# Altium project EVK-NORA-W40.PrjPcb (part 4 of 4)
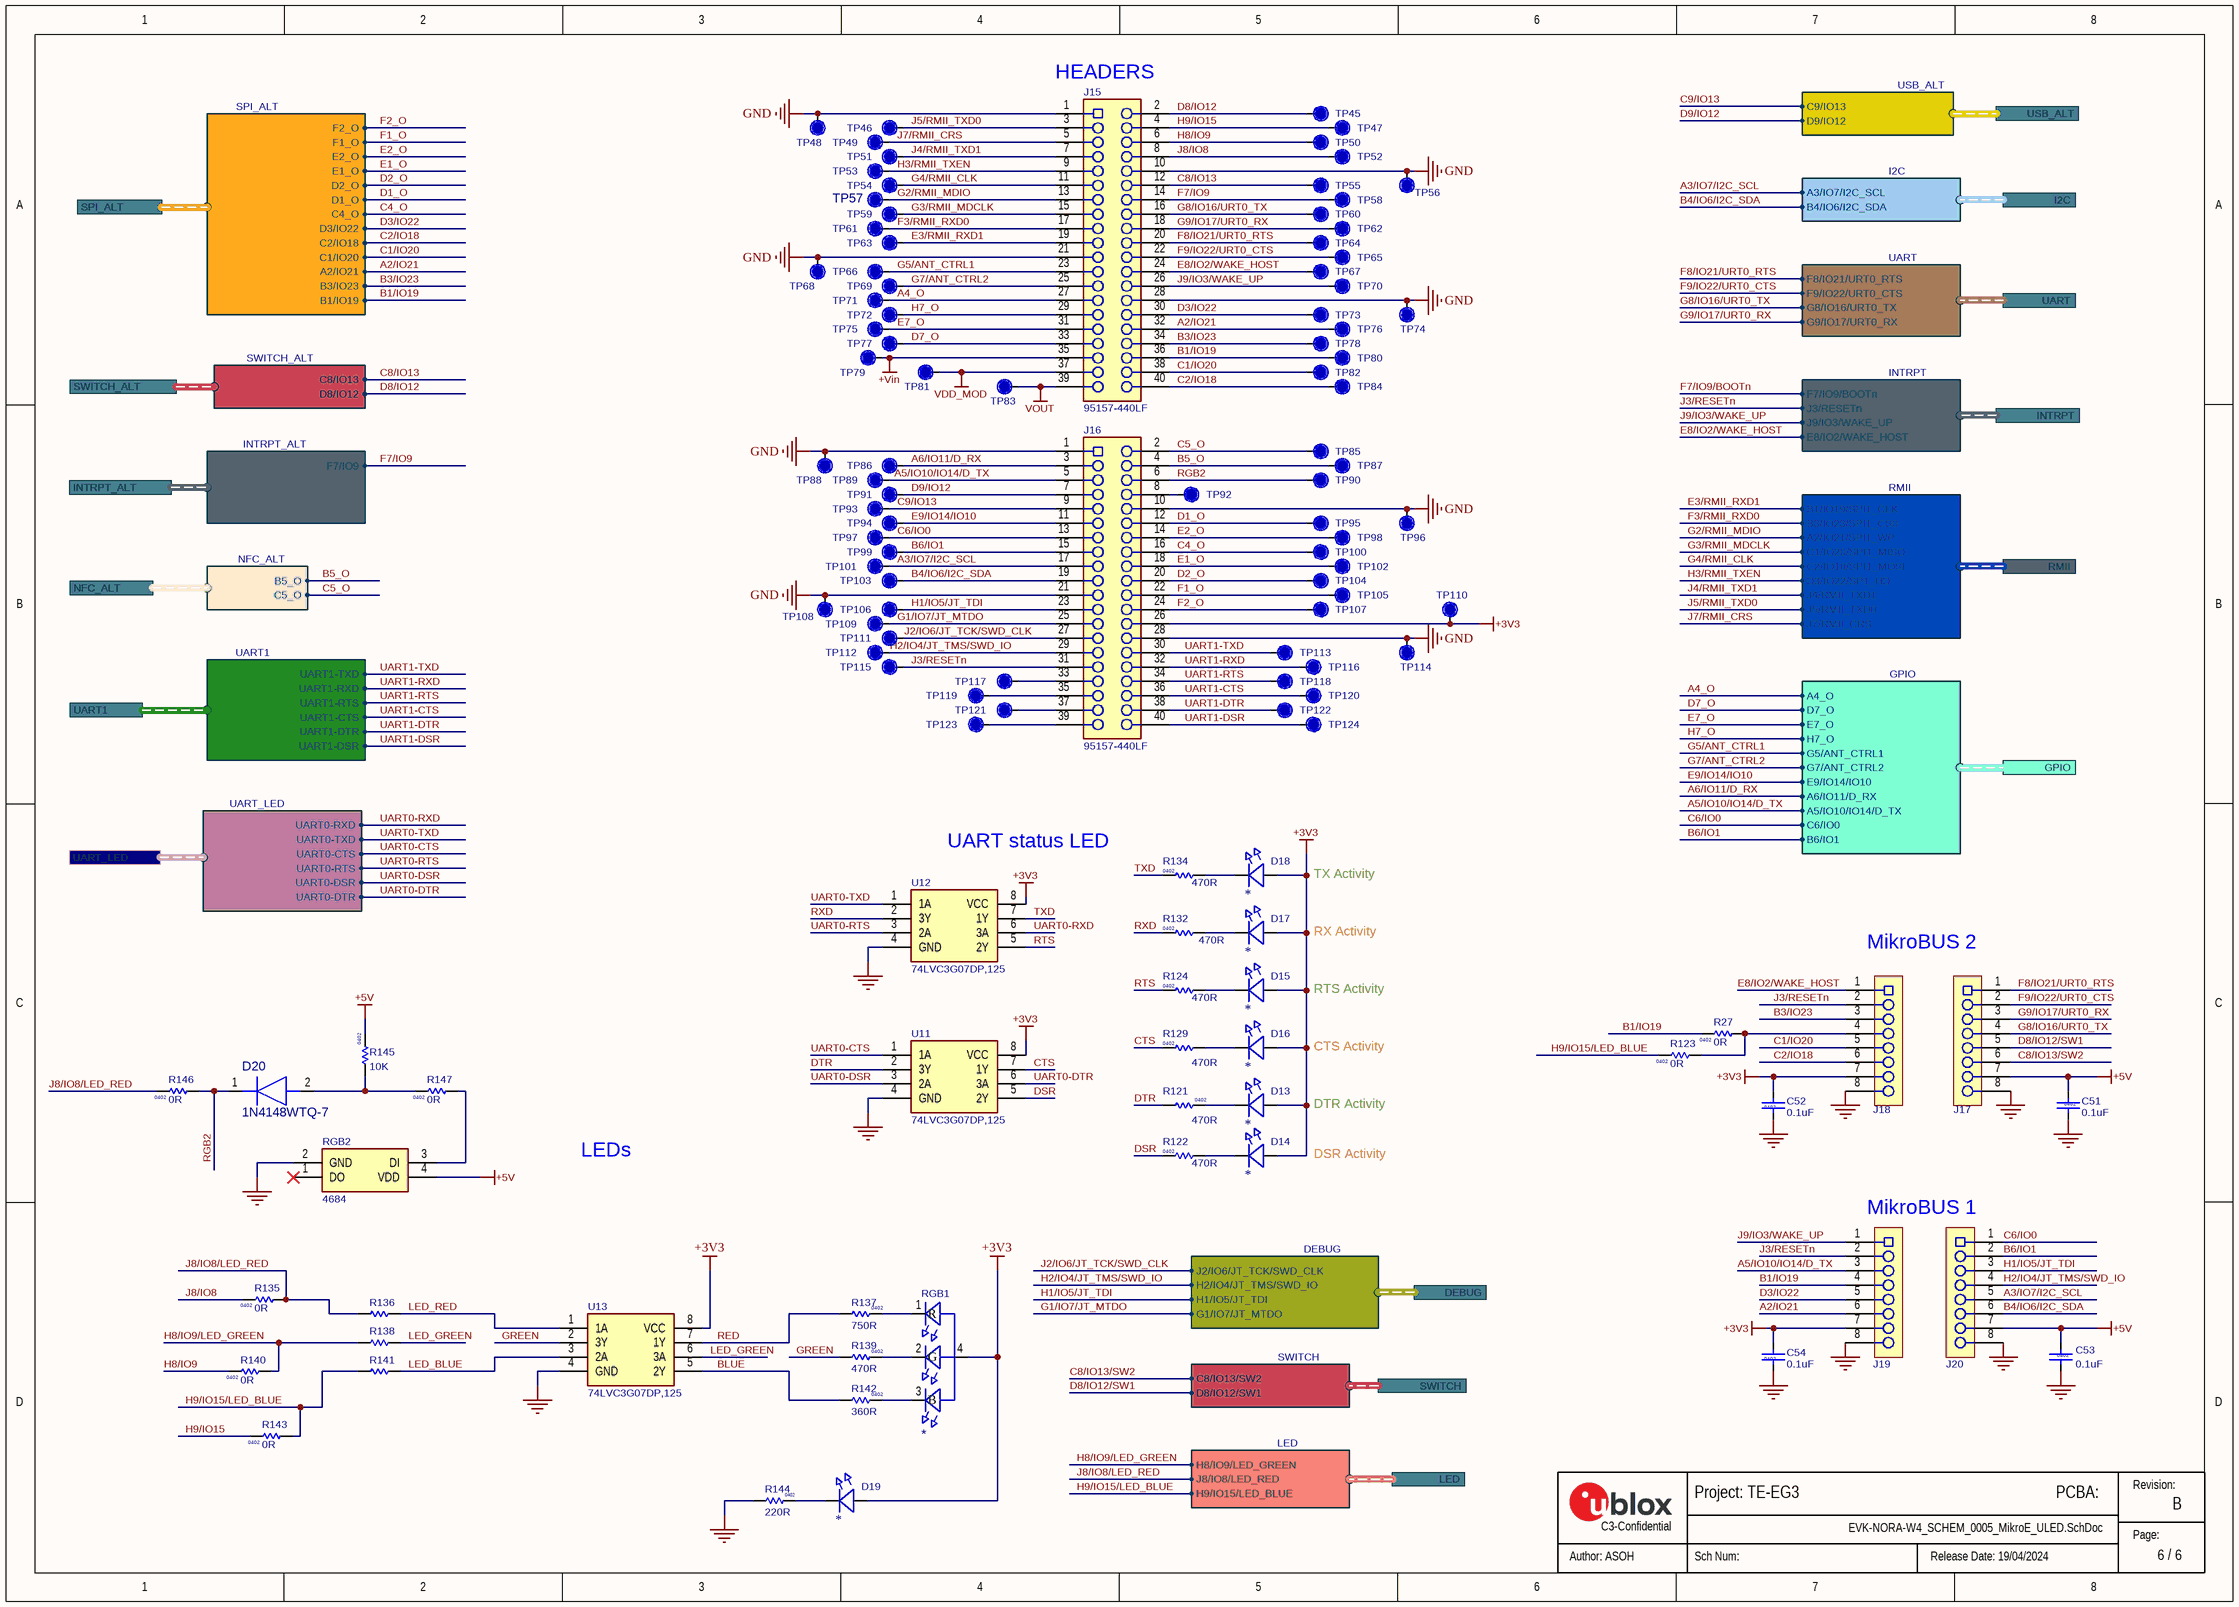
[diagram p6: EVK-NORA-W4_SCHEM_0005_MikroE_ULED.SchDoc]

## Nets that join several sheets
+3V3: EVK-NORA-W4_SCHEM_0001_Power (5 pins), EVK-NORA-W4_SCHEM_0003_USBhub_FTDI (13 pins), EVK-NORA-W4_SCHEM_0004_Debug_Memory (J12.2 R70.2 R71.2), EVK-NORA-W4_SCHEM_0005_MikroE_ULED (17 pins)
+5V: EVK-NORA-W4_SCHEM_0001_Power (R148.2 SW1.4), EVK-NORA-W4_SCHEM_0002_NORA_Module (R3.1), EVK-NORA-W4_SCHEM_0004_Debug_Memory (J11.5), EVK-NORA-W4_SCHEM_0005_MikroE_ULED (6 pins)
+Vin: EVK-NORA-W4_SCHEM_0001_Power (D2.A), EVK-NORA-W4_SCHEM_0005_MikroE_ULED (J15.35 TP79.1)
GND: EVK-NORA-W4_SCHEM_0001_Power (56 pins), EVK-NORA-W4_SCHEM_0002_NORA_Module (34 pins), EVK-NORA-W4_SCHEM_0003_USBhub_FTDI (35 pins), EVK-NORA-W4_SCHEM_0004_Debug_Memory (26 pins), EVK-NORA-W4_SCHEM_0005_MikroE_ULED (29 pins)
VDD_IO: EVK-NORA-W4_SCHEM_0001_Power (R36.2), EVK-NORA-W4_SCHEM_0002_NORA_Module (J4.2 R10.2 S1.2), EVK-NORA-W4_SCHEM_0003_USBhub_FTDI (R93.1 R111.1 TP28.1)
VDD_MOD: EVK-NORA-W4_SCHEM_0001_Power (7 pins), EVK-NORA-W4_SCHEM_0002_NORA_Module (J3.2 R6.2 S1.1), EVK-NORA-W4_SCHEM_0004_Debug_Memory (5 pins), EVK-NORA-W4_SCHEM_0005_MikroE_ULED (J15.37 TP81.1)
VDD_SPI: EVK-NORA-W4_SCHEM_0002_NORA_Module (U1.J1), EVK-NORA-W4_SCHEM_0004_Debug_Memory (R63.1 R75.1)
VOUT: EVK-NORA-W4_SCHEM_0001_Power (R29.1 R41.1 R148.1 SW1.1), EVK-NORA-W4_SCHEM_0005_MikroE_ULED (J15.39 TP83.1)
A2/IO21: EVK-NORA-W4_SCHEM_0004_Debug_Memory (R65.2), EVK-NORA-W4_SCHEM_0005_MikroE_ULED (J15.32 J19.6 TP76.1)
A2/IO21/SPI1_WP: EVK-NORA-W4_SCHEM_0002_NORA_Module (R4.1 S2.12), EVK-NORA-W4_SCHEM_0004_Debug_Memory (R65.1 U5.3)
A3/IO7/I2C_SCL: EVK-NORA-W4_SCHEM_0002_NORA_Module (R5.1 S2.10), EVK-NORA-W4_SCHEM_0004_Debug_Memory (R72.2), EVK-NORA-W4_SCHEM_0005_MikroE_ULED (J16.17 J20.5 TP101.1)
A4_O: EVK-NORA-W4_SCHEM_0002_NORA_Module (U1.A4), EVK-NORA-W4_SCHEM_0005_MikroE_ULED (J15.27 TP71.1)
A5/IO10/IO14/D_TX: EVK-NORA-W4_SCHEM_0002_NORA_Module (R7.1 S2.9), EVK-NORA-W4_SCHEM_0005_MikroE_ULED (J16.5 J19.3 TP89.1)
A6/IO11/D_RX: EVK-NORA-W4_SCHEM_0002_NORA_Module (U1.A6), EVK-NORA-W4_SCHEM_0005_MikroE_ULED (J16.3 TP86.1)
B1/IO19: EVK-NORA-W4_SCHEM_0004_Debug_Memory (R68.1), EVK-NORA-W4_SCHEM_0005_MikroE_ULED (J15.36 J19.4 R27.2 TP80.1)
B1/IO19/SPI1_CLK: EVK-NORA-W4_SCHEM_0002_NORA_Module (U1.B1), EVK-NORA-W4_SCHEM_0004_Debug_Memory (R68.2 U5.6)
B3/IO23: EVK-NORA-W4_SCHEM_0004_Debug_Memory (R66.1), EVK-NORA-W4_SCHEM_0005_MikroE_ULED (J15.34 J18.3 TP78.1)
B3/IO23/SPI1_CS0: EVK-NORA-W4_SCHEM_0002_NORA_Module (U1.B3), EVK-NORA-W4_SCHEM_0004_Debug_Memory (R66.2 U5.1)
B4/IO6/I2C_SDA: EVK-NORA-W4_SCHEM_0002_NORA_Module (R8.1 S2.11), EVK-NORA-W4_SCHEM_0004_Debug_Memory (R73.2), EVK-NORA-W4_SCHEM_0005_MikroE_ULED (J16.19 J20.6 TP103.1)
B5/NFC2: EVK-NORA-W4_SCHEM_0002_NORA_Module (U1.B5), EVK-NORA-W4_SCHEM_0003_USBhub_FTDI (C35.1 J14.4 R86.1)
B5_O: EVK-NORA-W4_SCHEM_0003_USBhub_FTDI (R86.2), EVK-NORA-W4_SCHEM_0005_MikroE_ULED (J16.4 TP87.1)
B6/IO1: EVK-NORA-W4_SCHEM_0002_NORA_Module (R25.2), EVK-NORA-W4_SCHEM_0005_MikroE_ULED (J16.15 J20.2 TP99.1)
C1/IO20: EVK-NORA-W4_SCHEM_0004_Debug_Memory (R67.2), EVK-NORA-W4_SCHEM_0005_MikroE_ULED (J15.38 J18.5 TP82.1)
C1/IO20/SPI1_MISO: EVK-NORA-W4_SCHEM_0002_NORA_Module (U1.C1), EVK-NORA-W4_SCHEM_0004_Debug_Memory (R67.1 U5.2)
C2/IO18: EVK-NORA-W4_SCHEM_0004_Debug_Memory (R69.2), EVK-NORA-W4_SCHEM_0005_MikroE_ULED (J15.40 J18.6 TP84.1)
C2/IO18/SPI1_MOSI: EVK-NORA-W4_SCHEM_0002_NORA_Module (U1.C2), EVK-NORA-W4_SCHEM_0004_Debug_Memory (R69.1 U5.5)
C4/SPI2_CS1: EVK-NORA-W4_SCHEM_0002_NORA_Module (U1.C4), EVK-NORA-W4_SCHEM_0004_Debug_Memory (R81.2 R82.2)
C4_O: EVK-NORA-W4_SCHEM_0004_Debug_Memory (R82.1), EVK-NORA-W4_SCHEM_0005_MikroE_ULED (J16.16 TP100.1)
C5/NFC1: EVK-NORA-W4_SCHEM_0002_NORA_Module (U1.C5), EVK-NORA-W4_SCHEM_0003_USBhub_FTDI (C34.2 J14.2 R85.2)
C5_O: EVK-NORA-W4_SCHEM_0003_USBhub_FTDI (R85.1), EVK-NORA-W4_SCHEM_0005_MikroE_ULED (J16.2 TP85.1)
C6/IO0: EVK-NORA-W4_SCHEM_0002_NORA_Module (R21.2), EVK-NORA-W4_SCHEM_0005_MikroE_ULED (J16.13 J20.1 TP97.1)
C8/IO13: EVK-NORA-W4_SCHEM_0004_Debug_Memory (R60.1), EVK-NORA-W4_SCHEM_0005_MikroE_ULED (J15.12 TP55.1)
C8/IO13/SW2: EVK-NORA-W4_SCHEM_0002_NORA_Module (R12.1 S3.12), EVK-NORA-W4_SCHEM_0004_Debug_Memory (D11.1 R60.2 SW4.1 SW4.2), EVK-NORA-W4_SCHEM_0005_MikroE_ULED (J17.6)
C9/IO13: EVK-NORA-W4_SCHEM_0002_NORA_Module (R1.2), EVK-NORA-W4_SCHEM_0005_MikroE_ULED (J16.9 TP93.1)
C9/IO13/USB_p: EVK-NORA-W4_SCHEM_0001_Power (D4.2 J5.A6 J5.B6 TP3.1), EVK-NORA-W4_SCHEM_0002_NORA_Module (C2.1 R1.1 R13.1 S3.11)
D1/SPI2_WP: EVK-NORA-W4_SCHEM_0002_NORA_Module (U1.D1), EVK-NORA-W4_SCHEM_0004_Debug_Memory (R77.1 U6.3)
D1_O: EVK-NORA-W4_SCHEM_0004_Debug_Memory (R77.2), EVK-NORA-W4_SCHEM_0005_MikroE_ULED (J16.12 TP95.1)
D2/SPI2_MOSI: EVK-NORA-W4_SCHEM_0002_NORA_Module (U1.D2), EVK-NORA-W4_SCHEM_0004_Debug_Memory (R83.1 U6.5)
D2_O: EVK-NORA-W4_SCHEM_0004_Debug_Memory (R83.2), EVK-NORA-W4_SCHEM_0005_MikroE_ULED (J16.20 TP104.1)
D3/IO22: EVK-NORA-W4_SCHEM_0004_Debug_Memory (R62.2), EVK-NORA-W4_SCHEM_0005_MikroE_ULED (J15.30 J19.5 TP73.1)
D3/IO22/SP1_HD: EVK-NORA-W4_SCHEM_0002_NORA_Module (R14.1 S2.13), EVK-NORA-W4_SCHEM_0004_Debug_Memory (R62.1 U5.7)
D7_O: EVK-NORA-W4_SCHEM_0002_NORA_Module (U1.D7), EVK-NORA-W4_SCHEM_0005_MikroE_ULED (J15.33 TP77.1)
D8/IO12: EVK-NORA-W4_SCHEM_0004_Debug_Memory (R57.1), EVK-NORA-W4_SCHEM_0005_MikroE_ULED (J15.2 TP45.1)
D8/IO12/SW1: EVK-NORA-W4_SCHEM_0002_NORA_Module (R15.1 S3.9), EVK-NORA-W4_SCHEM_0004_Debug_Memory (D10.1 R57.2 SW2.1 SW2.2), EVK-NORA-W4_SCHEM_0005_MikroE_ULED (J17.5)
D9/IO12: EVK-NORA-W4_SCHEM_0002_NORA_Module (R2.2), EVK-NORA-W4_SCHEM_0005_MikroE_ULED (J16.7 TP91.1)
D9/IO12/USB_n: EVK-NORA-W4_SCHEM_0001_Power (D4.1 J5.A7 J5.B7 TP2.1), EVK-NORA-W4_SCHEM_0002_NORA_Module (C1.1 R2.1 R16.1 S3.10)
E1/SPI2_CS0: EVK-NORA-W4_SCHEM_0002_NORA_Module (U1.E1), EVK-NORA-W4_SCHEM_0004_Debug_Memory (R78.2 R79.2)
E1_O: EVK-NORA-W4_SCHEM_0004_Debug_Memory (R78.1), EVK-NORA-W4_SCHEM_0005_MikroE_ULED (J16.18 TP102.1)
E2/SPI2_MISO: EVK-NORA-W4_SCHEM_0002_NORA_Module (U1.E2), EVK-NORA-W4_SCHEM_0004_Debug_Memory (R80.1 U6.2)
E2_O: EVK-NORA-W4_SCHEM_0004_Debug_Memory (R80.2), EVK-NORA-W4_SCHEM_0005_MikroE_ULED (J16.14 TP98.1)
E3/RMII_RXD1: EVK-NORA-W4_SCHEM_0002_NORA_Module (U1.E3), EVK-NORA-W4_SCHEM_0005_MikroE_ULED (J15.19 TP63.1)
E7_O: EVK-NORA-W4_SCHEM_0002_NORA_Module (U1.E7), EVK-NORA-W4_SCHEM_0005_MikroE_ULED (J15.31 TP75.1)
E8/IO2/WAKE_HOST: EVK-NORA-W4_SCHEM_0002_NORA_Module (U1.E8), EVK-NORA-W4_SCHEM_0003_USBhub_FTDI (R88.2 S4.8), EVK-NORA-W4_SCHEM_0005_MikroE_ULED (J15.24 J18.1 TP67.1)
E9/IO14/IO10: EVK-NORA-W4_SCHEM_0002_NORA_Module (C9.2 R19.1 S3.13), EVK-NORA-W4_SCHEM_0005_MikroE_ULED (J16.11 TP94.1)
F1/SPI2_CLK: EVK-NORA-W4_SCHEM_0002_NORA_Module (U1.F1), EVK-NORA-W4_SCHEM_0004_Debug_Memory (R84.2 U6.6)
F1_O: EVK-NORA-W4_SCHEM_0004_Debug_Memory (R84.1), EVK-NORA-W4_SCHEM_0005_MikroE_ULED (J16.22 TP105.1)
F2/SPI2_HD: EVK-NORA-W4_SCHEM_0002_NORA_Module (U1.F2), EVK-NORA-W4_SCHEM_0004_Debug_Memory (R74.1 U6.7)
F2_O: EVK-NORA-W4_SCHEM_0004_Debug_Memory (R74.2), EVK-NORA-W4_SCHEM_0005_MikroE_ULED (J16.24 TP107.1)
F3/RMII_RXD0: EVK-NORA-W4_SCHEM_0002_NORA_Module (U1.F3), EVK-NORA-W4_SCHEM_0005_MikroE_ULED (J15.17 TP61.1)
F7/IO9: EVK-NORA-W4_SCHEM_0004_Debug_Memory (R61.1), EVK-NORA-W4_SCHEM_0005_MikroE_ULED (J15.14 TP58.1)
F7/IO9/BOOTn: EVK-NORA-W4_SCHEM_0002_NORA_Module (R22.1 S3.16), EVK-NORA-W4_SCHEM_0003_USBhub_FTDI (R117.1), EVK-NORA-W4_SCHEM_0004_Debug_Memory (D12.1 R61.2 SW5.1 SW5.2)
F8/IO21/URT0_RTS: EVK-NORA-W4_SCHEM_0002_NORA_Module (R23.1 S3.15), EVK-NORA-W4_SCHEM_0003_USBhub_FTDI (R90.2 S4.10), EVK-NORA-W4_SCHEM_0005_MikroE_ULED (J15.20 J17.1 TP64.1)
F9/IO22/URT0_CTS: EVK-NORA-W4_SCHEM_0002_NORA_Module (R24.1 S3.14), EVK-NORA-W4_SCHEM_0003_USBhub_FTDI (R89.2 S4.9), EVK-NORA-W4_SCHEM_0005_MikroE_ULED (J15.22 J17.2 TP65.1)
G1/IO7/JT_MTDO: EVK-NORA-W4_SCHEM_0002_NORA_Module (R28.2 S2.14), EVK-NORA-W4_SCHEM_0004_Debug_Memory (J9.6 J11.6), EVK-NORA-W4_SCHEM_0005_MikroE_ULED (J16.25 TP109.1)
G2/RMII_MDIO: EVK-NORA-W4_SCHEM_0002_NORA_Module (U1.G2), EVK-NORA-W4_SCHEM_0005_MikroE_ULED (J15.13 TP57.1)
G3/RMII_MDCLK: EVK-NORA-W4_SCHEM_0002_NORA_Module (U1.G3), EVK-NORA-W4_SCHEM_0005_MikroE_ULED (J15.15 TP59.1)
G4/RMII_CLK: EVK-NORA-W4_SCHEM_0002_NORA_Module (U1.G4), EVK-NORA-W4_SCHEM_0005_MikroE_ULED (J15.11 TP54.1)
G5/ANT_CTRL1: EVK-NORA-W4_SCHEM_0002_NORA_Module (U1.G5), EVK-NORA-W4_SCHEM_0005_MikroE_ULED (J15.23 TP66.1)
G7/ANT_CTRL2: EVK-NORA-W4_SCHEM_0002_NORA_Module (U1.G7), EVK-NORA-W4_SCHEM_0005_MikroE_ULED (J15.25 TP69.1)
G8/IO16/URT0_TX: EVK-NORA-W4_SCHEM_0002_NORA_Module (U1.G8), EVK-NORA-W4_SCHEM_0003_USBhub_FTDI (R92.2 S4.12), EVK-NORA-W4_SCHEM_0005_MikroE_ULED (J15.16 J17.4 TP60.1)
G9/IO17/URT0_RX: EVK-NORA-W4_SCHEM_0002_NORA_Module (U1.G9), EVK-NORA-W4_SCHEM_0003_USBhub_FTDI (R91.2 S4.11), EVK-NORA-W4_SCHEM_0005_MikroE_ULED (J15.18 J17.3 TP62.1)
H1/IO5/JT_TDI: EVK-NORA-W4_SCHEM_0002_NORA_Module (U1.H1), EVK-NORA-W4_SCHEM_0004_Debug_Memory (J9.8 J11.8), EVK-NORA-W4_SCHEM_0005_MikroE_ULED (J16.23 J20.3 TP106.1)
H2/IO4/JT_TMS/SWD_IO: EVK-NORA-W4_SCHEM_0002_NORA_Module (U1.H2), EVK-NORA-W4_SCHEM_0004_Debug_Memory (J9.2 J11.2), EVK-NORA-W4_SCHEM_0005_MikroE_ULED (J16.29 J20.4 TP112.1)
H3/RMII_TXEN: EVK-NORA-W4_SCHEM_0002_NORA_Module (U1.H3), EVK-NORA-W4_SCHEM_0005_MikroE_ULED (J15.9 TP53.1)
H7_O: EVK-NORA-W4_SCHEM_0002_NORA_Module (U1.H7), EVK-NORA-W4_SCHEM_0005_MikroE_ULED (J15.29 TP72.1)
H8/IO9/LED_GREEN: EVK-NORA-W4_SCHEM_0002_NORA_Module (R20.2 S2.15), EVK-NORA-W4_SCHEM_0005_MikroE_ULED (R138.2 R140.1)
H9/IO15/LED_BLUE: EVK-NORA-W4_SCHEM_0002_NORA_Module (U1.H9), EVK-NORA-W4_SCHEM_0005_MikroE_ULED (R123.2 R141.2 R143.1)
J2/IO6/JT_TCK/SWD_CLK: EVK-NORA-W4_SCHEM_0002_NORA_Module (R18.2 S2.16), EVK-NORA-W4_SCHEM_0004_Debug_Memory (J9.4 J11.4), EVK-NORA-W4_SCHEM_0005_MikroE_ULED (J16.27 TP111.1)
J3/RESETn: EVK-NORA-W4_SCHEM_0002_NORA_Module (R17.2), EVK-NORA-W4_SCHEM_0003_USBhub_FTDI (R118.2), EVK-NORA-W4_SCHEM_0004_Debug_Memory (J9.10 J11.10 R59.1), EVK-NORA-W4_SCHEM_0005_MikroE_ULED (J16.31 J18.2 J19.2 TP115.1)
J4/RMII_TXD1: EVK-NORA-W4_SCHEM_0002_NORA_Module (U1.J4), EVK-NORA-W4_SCHEM_0005_MikroE_ULED (J15.7 TP51.1)
J5/RMII_TXD0: EVK-NORA-W4_SCHEM_0002_NORA_Module (U1.J5), EVK-NORA-W4_SCHEM_0005_MikroE_ULED (J15.3 TP46.1)
J7/RMII_CRS: EVK-NORA-W4_SCHEM_0002_NORA_Module (U1.J7), EVK-NORA-W4_SCHEM_0005_MikroE_ULED (J15.5 TP49.1)
J8/IO8/LED_RED: EVK-NORA-W4_SCHEM_0002_NORA_Module (U1.J8), EVK-NORA-W4_SCHEM_0005_MikroE_ULED (R135.1 R136.2 R146.2)
J9/IO3/WAKE_UP: EVK-NORA-W4_SCHEM_0002_NORA_Module (U1.J9), EVK-NORA-W4_SCHEM_0003_USBhub_FTDI (R87.2 S4.7), EVK-NORA-W4_SCHEM_0005_MikroE_ULED (J15.26 J19.1 TP70.1)
UART0-CTS: EVK-NORA-W4_SCHEM_0003_USBhub_FTDI (6 pins), EVK-NORA-W4_SCHEM_0005_MikroE_ULED (U11.1)
UART0-DSR: EVK-NORA-W4_SCHEM_0003_USBhub_FTDI (6 pins), EVK-NORA-W4_SCHEM_0005_MikroE_ULED (U11.3)
UART0-DTR: EVK-NORA-W4_SCHEM_0003_USBhub_FTDI (R88.1 S4.5 TP30.1 U7.4), EVK-NORA-W4_SCHEM_0005_MikroE_ULED (U11.6)
UART0-RTS: EVK-NORA-W4_SCHEM_0003_USBhub_FTDI (R90.1 S4.3 TP26.1 U7.6), EVK-NORA-W4_SCHEM_0005_MikroE_ULED (U12.3)
UART0-RXD: EVK-NORA-W4_SCHEM_0003_USBhub_FTDI (R91.1 S4.2 TP31.1 U7.17), EVK-NORA-W4_SCHEM_0005_MikroE_ULED (U12.6)
UART0-TXD: EVK-NORA-W4_SCHEM_0003_USBhub_FTDI (R92.1 S4.1 TP42.1 U7.1), EVK-NORA-W4_SCHEM_0005_MikroE_ULED (U12.1)
UART1-CTS: EVK-NORA-W4_SCHEM_0003_USBhub_FTDI (U9.6), EVK-NORA-W4_SCHEM_0005_MikroE_ULED (J16.36 TP120.1)
UART1-DSR: EVK-NORA-W4_SCHEM_0003_USBhub_FTDI (U9.4), EVK-NORA-W4_SCHEM_0005_MikroE_ULED (J16.40 TP124.1)
UART1-DTR: EVK-NORA-W4_SCHEM_0003_USBhub_FTDI (U9.18), EVK-NORA-W4_SCHEM_0005_MikroE_ULED (J16.38 TP122.1)
UART1-RTS: EVK-NORA-W4_SCHEM_0003_USBhub_FTDI (U9.19), EVK-NORA-W4_SCHEM_0005_MikroE_ULED (J16.34 TP118.1)
UART1-RXD: EVK-NORA-W4_SCHEM_0003_USBhub_FTDI (U9.1), EVK-NORA-W4_SCHEM_0005_MikroE_ULED (J16.32 TP116.1)
UART1-TXD: EVK-NORA-W4_SCHEM_0003_USBhub_FTDI (U9.17), EVK-NORA-W4_SCHEM_0005_MikroE_ULED (J16.30 TP113.1)
USB_n: EVK-NORA-W4_SCHEM_0001_Power (D7.1 J6.A7 J6.B7 TP4.1), EVK-NORA-W4_SCHEM_0003_USBhub_FTDI (R106.2 R108.2)
USB_p: EVK-NORA-W4_SCHEM_0001_Power (D7.2 J6.A6 J6.B6 TP5.1), EVK-NORA-W4_SCHEM_0003_USBhub_FTDI (R109.2 R110.2)

## Assembly variants
EVK-NORA-W401: not fitted C1 C2 C3 C8 C9 C16 C17 C18 C19 C21 C22 C23 C25 C26 C27 C28 C30 C31 C32 C33 C34 C35 C50 D4 D8 J2 J8 J9 J10 J11 J13 J14 L1 L2 L3 R1 R2 R3 R4 R5 R6 R7 R8 R9 R10 R11 R12 R13 R14 R15 R16 R18 R19 R20 R22 R23 R24 R28 R31 R32 R34 R35 R41 R42 R43 R44 R45 R48 R50 R51 R52 R53 R54 R55 R56 R63 R64 R74 R75 R76 R77 R78 R79 R80 R81 R82 R83 R84 R85 R86 R87 R88 R89 R90 R91 R92 R93 R95 R99 R102 R103 R106 R107 R109 R111 R114 R115 R123 R136 R137 R138 R139 R141 R142 R148 RGB1 RT1 U3 U4 U5 U6 U13
EVK-NORA-W406: not fitted C1 C2 C3 C8 C9 C16 C17 C18 C19 C21 C22 C23 C25 C26 C27 C28 C30 C31 C32 C33 C34 C35 C50 D4 D8 J1 J2 J8 J9 J10 J11 J13 J14 L1 L2 L3 R1 R2 R3 R4 R5 R6 R7 R8 R9 R10 R11 R12 R13 R14 R15 R16 R18 R19 R20 R22 R23 R24 R28 R31 R32 R34 R35 R41 R42 R43 R44 R45 R48 R50 R51 R52 R53 R54 R55 R56 R63 R64 R74 R75 R76 R77 R78 R79 R80 R81 R82 R83 R84 R85 R86 R87 R88 R89 R90 R91 R92 R93 R95 R99 R102 R103 R106 R107 R109 R111 R114 R115 R123 R136 R137 R138 R139 R141 R142 R148 RGB1 RT1 U3 U4 U5 U6 U13